# EAGLE design pcb-breakout-bmd300 (EAGLE 7.5.0)
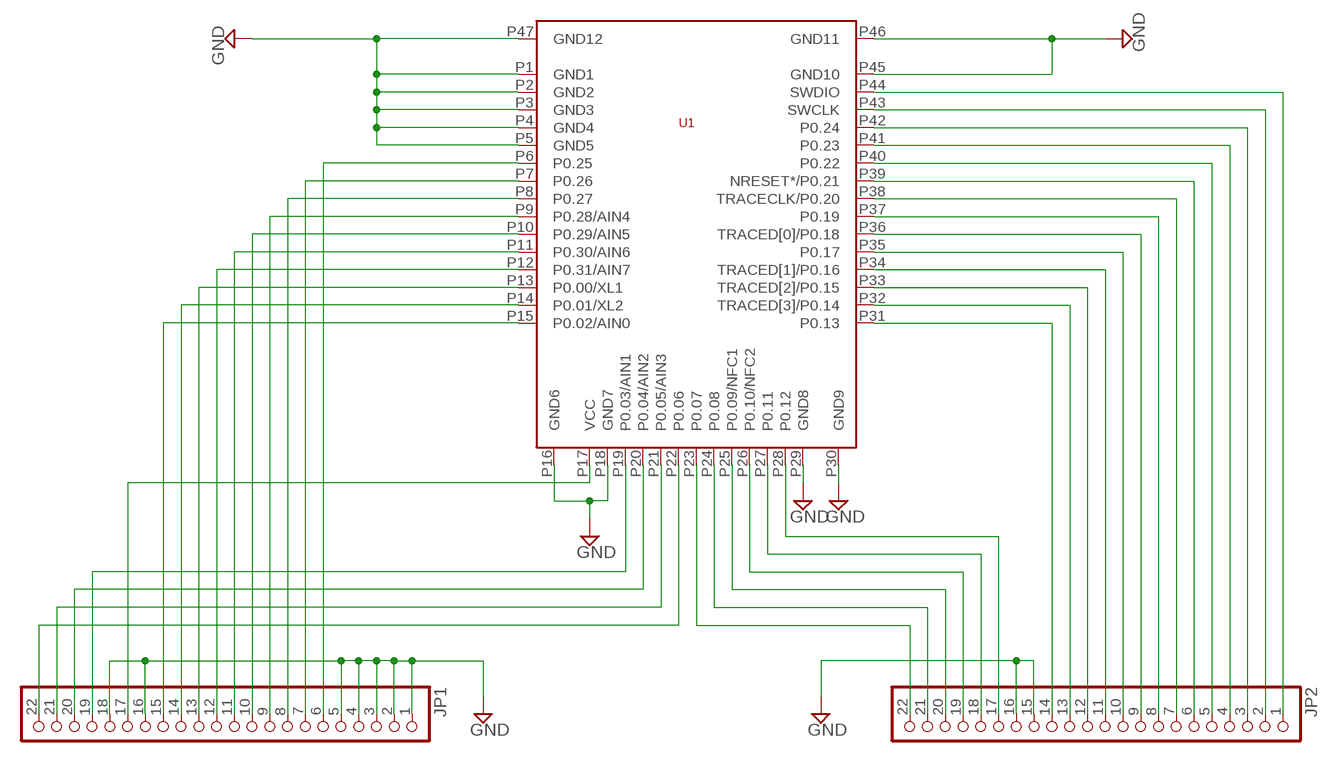
[diagram p0: schematic, sheet 1]

## Parts
JP1  PINHD-1X22  [1X22]
JP2  PINHD-1X22  [1X22]
U1  BMD-300  [BMD-300]

## Nets
GND: JP1.1 JP1.2 JP1.3 JP1.4 JP1.5 JP1.16 JP1.18 JP2.15 JP2.16 U1.P1(GND1) U1.P2(GND2) U1.P3(GND3) U1.P4(GND4) U1.P5(GND5) U1.P16(GND6) U1.P18(GND7) U1.P29(GND8) U1.P30(GND9) U1.P45(GND10) U1.P46(GND11) U1.P47(GND12)
N$1: JP1.6 U1.P6(P0.25)
N$2: JP1.7 U1.P7(P0.26)
N$3: JP1.8 U1.P8(P0.27)
N$4: JP1.9 U1.P9(P0.28/AIN4)
N$5: JP1.10 U1.P10(P0.29/AIN5)
N$6: JP1.11 U1.P11(P0.30/AIN6)
N$7: JP1.12 U1.P12(P0.31/AIN7)
N$8: JP1.13 U1.P13(P0.00/XL1)
N$9: JP1.14 U1.P14(P0.01/XL2)
N$10: JP1.15 U1.P15(P0.02/AIN0)
N$11: JP1.17 U1.P17(VCC)
N$12: JP1.19 U1.P19(P0.03/AIN1)
N$13: JP1.20 U1.P20(P0.04/AIN2)
N$14: JP1.21 U1.P21(P0.05/AIN3)
N$15: JP1.22 U1.P22(P0.06)
N$16: JP2.22 U1.P23(P0.07)
N$17: JP2.21 U1.P24(P0.08)
N$18: JP2.20 U1.P25(P0.09/NFC1)
N$19: JP2.19 U1.P26(P0.10/NFC2)
N$20: JP2.18 U1.P27(P0.11)
N$21: JP2.17 U1.P28(P0.12)
N$22: JP2.14 U1.P31(P0.13)
N$23: JP2.13 U1.P32(TRACED[3]/P0.14)
N$24: JP2.12 U1.P33(TRACED[2]/P0.15)
N$25: JP2.11 U1.P34(TRACED[1]/P0.16)
N$26: JP2.10 U1.P35(P0.17)
N$27: JP2.9 U1.P36(TRACED[0]/P0.18)
N$28: JP2.8 U1.P37(P0.19)
N$29: JP2.7 U1.P38(TRACECLK/P0.20)
N$30: JP2.6 U1.P39(NRESET*/P0.21)
N$31: JP2.5 U1.P40(P0.22)
N$32: JP2.4 U1.P41(P0.23)
N$33: JP2.3 U1.P42(P0.24)
N$34: JP2.2 U1.P43(SWCLK)
N$35: JP2.1 U1.P44(SWDIO)

## Library data of the parts
JP1 JP2 = pinhead:PINHD-1X22: PIN HEADER
U1 = BMD-300:BMD-300

## Board
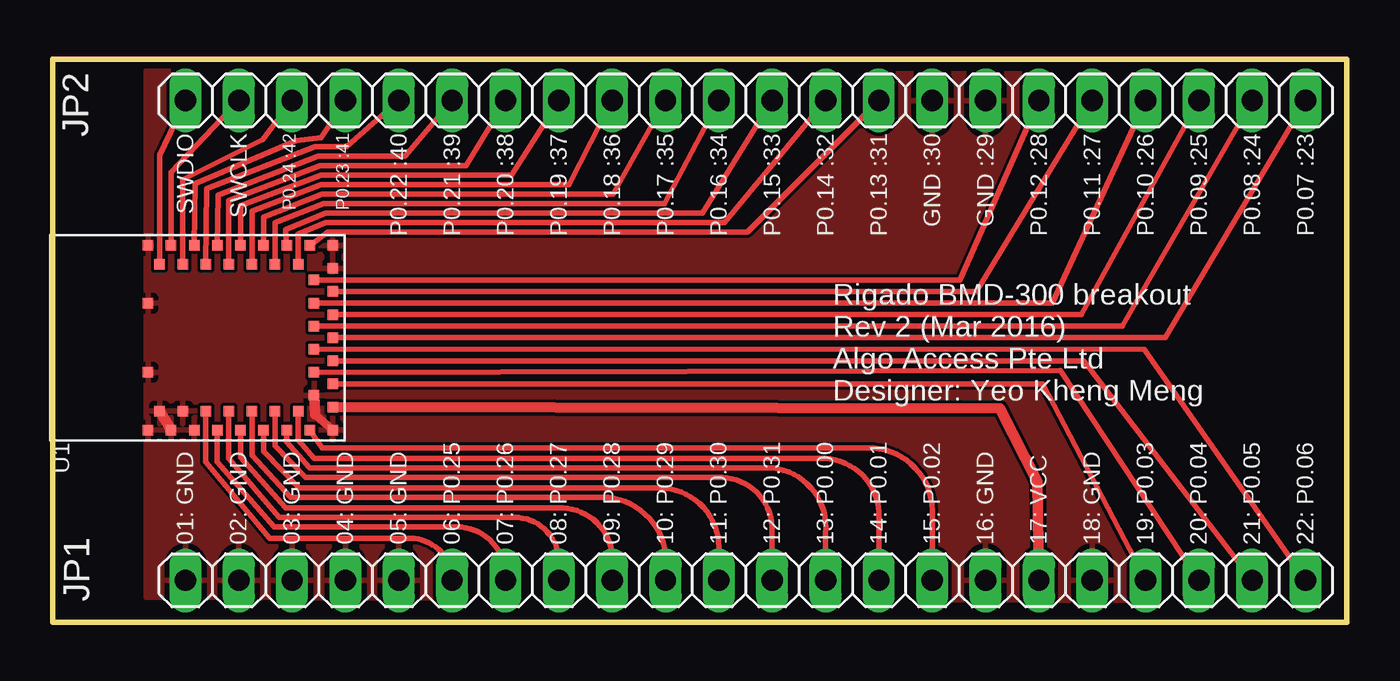
[diagram p1: board, top side]
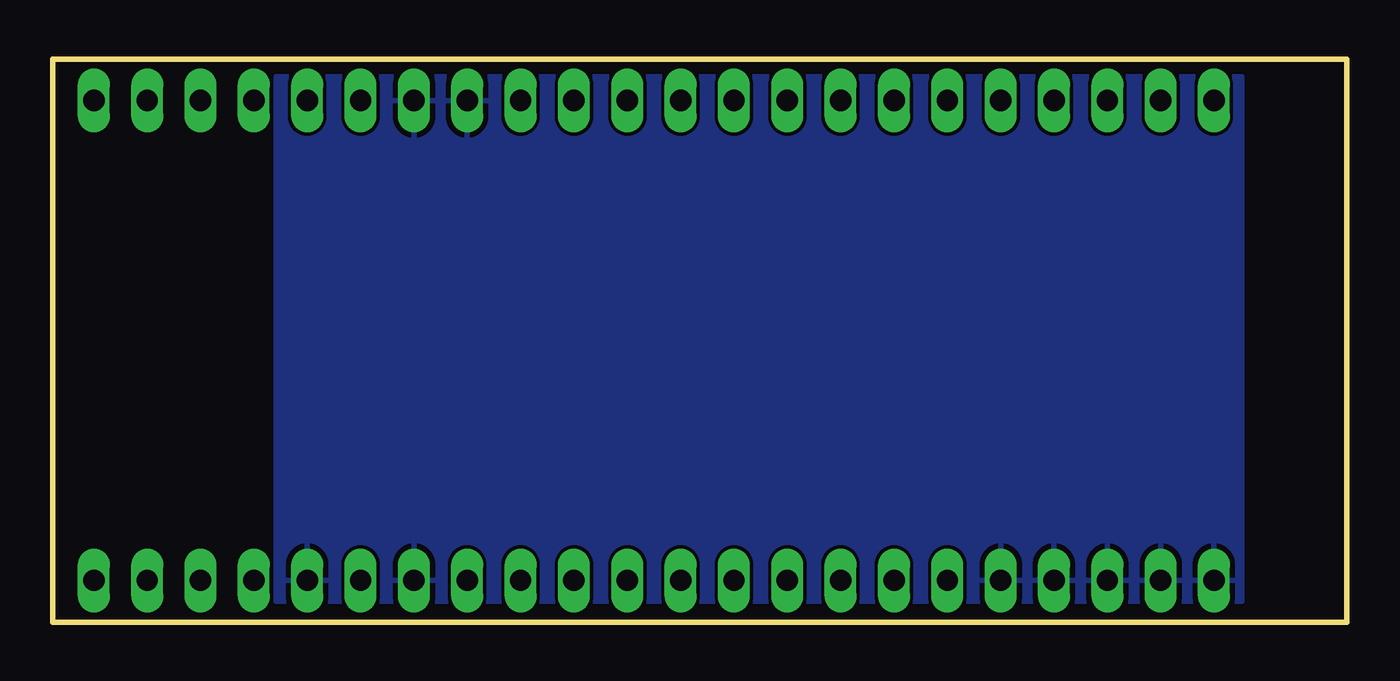
[diagram p2: board, bottom side, seen from below]

Size 61.64 x 26.82 mm. Coordinates in mm from the lower left corner, seen from the top.
Outline: 0,0 61.64,0 61.64,26.82 0,26.82 0,0
Copper layers (1*16): Top 0.035mm / dielectric 1.5mm / Bottom 0.035mm
Design rules "Elecrow_2-layer_eagle_rule": minimum track width 6mil, minimum drill 12mil, track to track 6mil, track to pad 6mil, pad to pad 6mil, via to via 6mil, smd to smd 0mil, copper to edge 10mil, drill to drill 10mil, minimum pad ring 10mil, minimum via ring 6mil, stop-mask expansion 2mil, vias tented up to drill 100mil, thermal gap 10mil

### Footprints (pad centres in the part's own frame; a part is rotated, then mirrored left to right if it is on the bottom)
1X22 = drill 1.016 long: 1 -26.67,0; 2 -24.13,0; 3 -21.59,0; 4 -19.05,0; 5 -16.51,0; 6 -13.97,0; 7 -11.43,0; 8 -8.89,0; 9 -6.35,0; 10 -3.81,0; 11 -1.27,0; 12 1.27,0; 13 3.81,0; 14 6.35,0; 15 8.89,0; 16 11.43,0; 17 13.97,0; 18 16.51,0; 19 19.05,0; 20 21.59,0; 21 24.13,0; 22 26.67,0
BMD-300 = smd 0.5 x 0.5: P1 0.5,9.35; P2 1.4,8.8; P3 0.5,8.25; P4 1.4,7.7; P5 0.5,7.15; P6 1.4,6.6; P7 0.5,6.05; P8 1.4,5.5; P9 0.5,4.95; P10 1.4,4.4; P11 0.5,3.85; P12 1.4,3.3; P13 0.5,2.75; P14 1.4,2.2; P15 0.5,1.65; P16 0.5,0.55; P17 1.6,0.55; P18 2.15,1.45; P19 2.7,0.55; P20 3.25,1.45; P21 3.8,0.55; P22 4.35,1.45; P23 4.9,0.55; P24 5.45,1.45; P25 6,0.55; P26 6.55,1.45; P27 7.1,0.55; P28 7.65,1.45; P29 8.2,0.55; P30 9.3,0.55; P31 9.3,1.65; P32 8.4,2.2; P33 9.3,2.75; P34 8.4,3.3; P35 9.3,3.85; P36 8.4,4.4; P37 9.3,4.95; P38 8.4,5.5; P39 9.3,6.05; P40 8.4,6.6; P41 9.3,7.15; P42 8.4,7.7; P43 9.3,8.25; P44 8.4,8.8; P45 9.3,9.35; P46 6.55,9.35; P47 3.25,9.35

### Placement (x,y rotation side)
JP1  33,2 0 top
JP2  33,24.86 0 top
U1  13.9,8.66 90 top

### Tracks (layer width: path | path; a pad name or v marks a point on that pad's centre or on a via)
GND
  Top 0.406: U1.P16 12.5,9.9
  Top 0.5: U1.P2 U1.P3 | U1.P18 12.5,9.9
  pour Top: 4.45,26.28 61,26.08 61,1 4.45,1.2
  pour Bottom: 5,26 51,26 51,1 5,1
N$1
  Top 0.25: U1.P6 7.3,7.65 10.35,4 17.03,4 arc-90 JP1.6
N$2
  Top 0.25: U1.P7 7.85,7.65 10.55,4.55 19.25,4.55 arc-90 21.57,2.23 JP1.7
N$3
  Top 0.25: U1.P8 8.4,7.8 10.8,5 22,5 arc-90 24.11,2.89 JP1.8
N$4
  Top 0.25: U1.P9 8.95,7.85 11.1,5.45 24.3,5.45 arc-90 26.65,2.9 JP1.9
N$5
  Top 0.25: U1.P10 9.5,7.95 11.35,5.95 26.45,5.95 arc-90 29.19,2.61 JP1.10
N$6
  Top 0.25: U1.P11 10.05,8.15 11.75,6.4 28.9,6.4 arc-90 31.73,3.57 JP1.11
N$7
  Top 0.25: U1.P12 10.6,8.4 12.05,6.9 31.9,6.9 arc-90 34.27,4.33 JP1.12
N$8
  Top 0.25: U1.P13 11.15,8.6 12.25,7.35 34.3,7.35 arc-90 36.81,4.24 JP1.13
N$9
  Top 0.25: U1.P14 11.7,8.7 12.45,7.8 36.8,7.8 arc-90 39.35,5 JP1.14
N$10
  Top 0.25: JP1.15 41.89,5.06 arc90 39.1,8.3 12.85,8.3 U1.P15
N$11
  Top 0.5: U1.P17 45.1,10.2 46.9,6.7 JP1.17
N$12
  Top 0.25: U1.P19 47.15,11.36 JP1.19
N$13
  Top 0.25: U1.P20 48,12 JP1.20
N$14
  Top 0.25: U1.P21 49.1,12.45 JP1.21
N$15
  Top 0.25: U1.P22 52,13 JP1.22
N$16
  Top 0.25: U1.P23 53,13.56 JP2.22
N$17
  Top 0.25: U1.P24 50.95,14.11 JP2.21
N$18
  Top 0.25: U1.P25 49,14.66 JP2.20
N$19
  Top 0.25: U1.P26 47.6,15.21 JP2.19
N$20
  Top 0.25: U1.P27 44,15.76 JP2.18
N$21
  Top 0.25: U1.P28 43.2,16.31 JP2.17
N$22
  Top 0.25: U1.P31 13.1,18.6 33.09,18.6 JP2.14
N$23
  Top 0.25: U1.P32 11.7,18.5 13,19.05 32,19.05 JP2.13
N$24
  Top 0.25: U1.P33 11.1,18.7 13,19.5 30.95,19.5 JP2.12
N$25
  Top 0.25: U1.P34 10.6,19.05 12.9,19.95 29.15,19.95 JP2.11
N$26
  Top 0.25: U1.P35 10.05,19.3 12.85,20.4 26.7,20.4 JP2.10
N$27
  Top 0.25: U1.P36 9.5,19.6 12.8,20.85 24.6,20.85 JP2.9
N$28
  Top 0.25: U1.P37 8.95,19.85 12.8,21.3 21.85,21.3 JP2.8
N$29
  Top 0.25: U1.P38 8.4,20.1 12.75,21.75 19.7,21.75 JP2.7
N$30
  Top 0.25: U1.P39 7.9,20.35 12.65,22.2 16.8,22.2 JP2.6
N$31
  Top 0.25: U1.P40 7.35,20.65 12.5,22.65 14,22.65 JP2.5
N$32
  Top 0.25: U1.P41 6.8,20.9 11.6,22.95 12.8,23.1 JP2.4
N$33
  Top 0.25: U1.P42 6.2,21.1 10,23 JP2.3
N$34
  Top 0.25: U1.P43 5.65,21.45 JP2.2
N$35
  Top 0.25: U1.P44 5.1,22.25 JP2.1

### Text on the board
tPlace: SWDIO | SWCLK | P0.24 :42 | P0.23 :41 | P0.22 :40 | P0.21 :39 | P0.20 :38 | P0.19 :37 | P0.18 :36 | P0.17 :35 | P0.16 :34 | P0.15 :33 | P0.14 :32 | P0.13 :31 | GND :30 | GND :29 | P0.12 :28 | P0.11 :27 | P0.10 :26 | P0.09 :25 | P0.08 :24 | P0.07 :23 | Rigado BMD-300 breakout / Rev 2 (Mar 2016) / Algo Access Pte Ltd / Designer: Yeo Kheng Meng | 01: GND | 02: GND | 03: GND | 04: GND | 05: GND | 06: P0.25 | 07: P0.26 | 08: P0.27 | 09: P0.28 | 10: P0.29 | 11: P0.30 | 12: P0.31 | 13: P0.00 | 14: P0.01 | 15: P0.02 | 16: GND | 17: VCC | 18: GND | 19: P0.03 | 20: P0.04 | 21: P0.05 | 22: P0.06